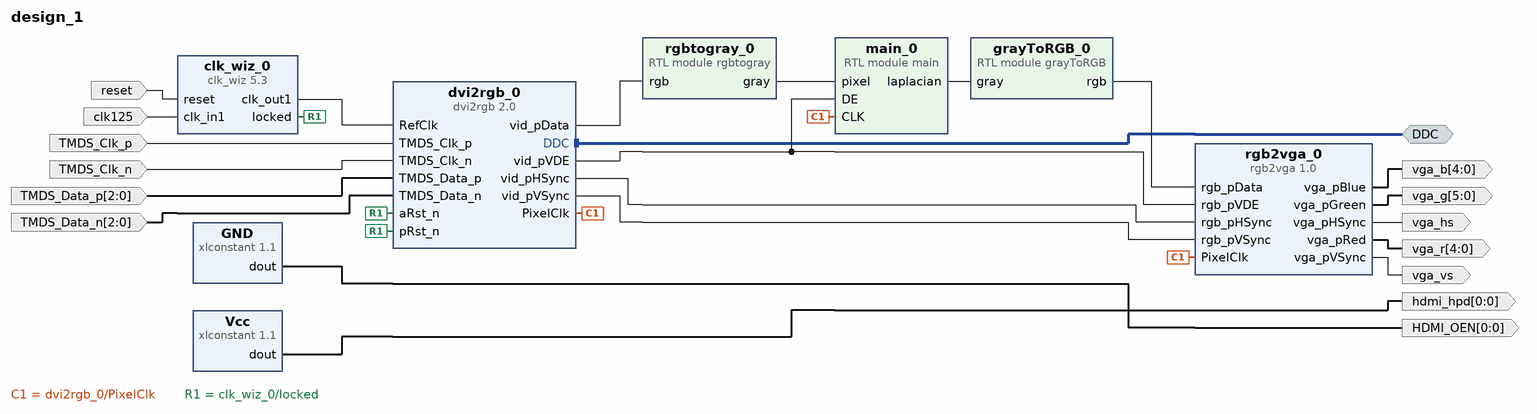
[diagram p0: block diagram of the top level]
# Vivado block design design_1, xc7z010clg400-1, Vivado 2016.4
create_bd_design design_1

create_bd_intf_port -mode Master -vlnv xilinx.com:interface:iic_rtl:1.0 DDC
create_bd_port -dir O -from 4 -to 0 vga_r
create_bd_port -dir O -from 5 -to 0 vga_g
create_bd_port -dir O -from 4 -to 0 vga_b
create_bd_port -dir O vga_hs
create_bd_port -dir O vga_vs
create_bd_port -dir I -type clk TMDS_Clk_p
set_property -dict {CONFIG.FREQ_HZ 100000000} [get_bd_ports TMDS_Clk_p]
create_bd_port -dir I -type clk TMDS_Clk_n
set_property -dict {CONFIG.FREQ_HZ 100000000} [get_bd_ports TMDS_Clk_n]
create_bd_port -dir I -from 2 -to 0 TMDS_Data_p
create_bd_port -dir I -from 2 -to 0 TMDS_Data_n
create_bd_port -dir O -from 0 -to 0 HDMI_OEN
create_bd_port -dir O -from 0 -to 0 hdmi_hpd
create_bd_port -dir I -type rst reset
set_property -dict {CONFIG.POLARITY ACTIVE_HIGH} [get_bd_ports reset]
create_bd_port -dir I -type clk clk125
set_property -dict {CONFIG.FREQ_HZ 125000000 CONFIG.CLK_DOMAIN design_1_clk125} [get_bd_ports clk125]

create_bd_cell -type ip -vlnv digilentinc.com:ip:rgb2vga:1.0 rgb2vga_0
set_property -dict {CONFIG.kBlueDepth 5 CONFIG.kGreenDepth 6 CONFIG.kRedDepth 5} [get_bd_cells rgb2vga_0]
create_bd_cell -type module -reference rgbtogray rgbtogray_0
create_bd_cell -type module -reference grayToRGB grayToRGB_0
create_bd_cell -type ip -vlnv xilinx.com:ip:xlconstant:1.1 GND
set_property -dict {CONFIG.CONST_VAL 0} [get_bd_cells GND]
create_bd_cell -type ip -vlnv xilinx.com:ip:xlconstant:1.1 Vcc
create_bd_cell -type ip -vlnv xilinx.com:ip:clk_wiz:5.3 clk_wiz_0
set_property -dict [list \
  CONFIG.PRIMITIVE PLL \
  CONFIG.PRIM_IN_FREQ 125.000 \
  CONFIG.CLKIN1_JITTER_PS 80.0 \
  CONFIG.CLKOUT1_REQUESTED_OUT_FREQ 100 \
  CONFIG.CLKOUT1_DRIVES BUFG \
  CONFIG.CLKOUT2_DRIVES BUFG \
  CONFIG.CLKOUT3_DRIVES BUFG \
  CONFIG.CLKOUT4_DRIVES BUFG \
  CONFIG.CLKOUT5_DRIVES BUFG \
  CONFIG.CLKOUT6_DRIVES BUFG \
  CONFIG.CLKOUT7_DRIVES BUFG \
  CONFIG.MMCM_DIVCLK_DIVIDE 5 \
  CONFIG.MMCM_CLKFBOUT_MULT_F 36 \
  CONFIG.MMCM_CLKIN1_PERIOD 8.0 \
  CONFIG.MMCM_COMPENSATION ZHOLD \
  CONFIG.MMCM_CLKOUT0_DIVIDE_F 9 \
  CONFIG.CLK_IN1_BOARD_INTERFACE sys_clock \
  CONFIG.CLKOUT1_JITTER 237.312 \
  CONFIG.CLKOUT1_PHASE_ERROR 249.865 \
] [get_bd_cells clk_wiz_0]
create_bd_cell -type module -reference main main_0
create_bd_cell -type ip -vlnv digilentinc.com:ip:dvi2rgb:2.0 dvi2rgb_0
set_property -dict [list \
  CONFIG.kRstActiveHigh false \
  CONFIG.kClkRange 2 \
  CONFIG.kEdidFileName dgl_720p_cea.data \
] [get_bd_cells dvi2rgb_0]

# ---- connections ----

connect_bd_intf_net [get_bd_intf_ports DDC] [get_bd_intf_pins dvi2rgb_0/DDC]
connect_bd_net [get_bd_pins dvi2rgb_0/vid_pData] [get_bd_pins rgbtogray_0/rgb]
connect_bd_net [get_bd_pins rgbtogray_0/gray] [get_bd_pins main_0/pixel]
connect_bd_net [get_bd_pins main_0/laplacian] [get_bd_pins grayToRGB_0/gray]
connect_bd_net [get_bd_pins grayToRGB_0/rgb] [get_bd_pins rgb2vga_0/rgb_pData]
connect_bd_net [get_bd_pins dvi2rgb_0/PixelClk] [get_bd_pins rgb2vga_0/PixelClk] [get_bd_pins main_0/CLK]
connect_bd_net [get_bd_pins dvi2rgb_0/vid_pHSync] [get_bd_pins rgb2vga_0/rgb_pHSync]
connect_bd_net [get_bd_pins dvi2rgb_0/vid_pVSync] [get_bd_pins rgb2vga_0/rgb_pVSync]
connect_bd_net [get_bd_pins dvi2rgb_0/vid_pVDE] [get_bd_pins rgb2vga_0/rgb_pVDE] [get_bd_pins main_0/DE]
connect_bd_net [get_bd_pins rgb2vga_0/vga_pRed] [get_bd_ports vga_r]
connect_bd_net [get_bd_pins rgb2vga_0/vga_pGreen] [get_bd_ports vga_g]
connect_bd_net [get_bd_pins rgb2vga_0/vga_pBlue] [get_bd_ports vga_b]
connect_bd_net [get_bd_pins rgb2vga_0/vga_pHSync] [get_bd_ports vga_hs]
connect_bd_net [get_bd_pins rgb2vga_0/vga_pVSync] [get_bd_ports vga_vs]
connect_bd_net [get_bd_ports TMDS_Clk_p] [get_bd_pins dvi2rgb_0/TMDS_Clk_p]
connect_bd_net [get_bd_ports TMDS_Clk_n] [get_bd_pins dvi2rgb_0/TMDS_Clk_n]
connect_bd_net [get_bd_ports TMDS_Data_p] [get_bd_pins dvi2rgb_0/TMDS_Data_p]
connect_bd_net [get_bd_ports TMDS_Data_n] [get_bd_pins dvi2rgb_0/TMDS_Data_n]
connect_bd_net -net xlconstant_0_dout [get_bd_pins GND/dout] [get_bd_ports HDMI_OEN]
connect_bd_net -net xlconstant_1_dout [get_bd_pins Vcc/dout] [get_bd_ports hdmi_hpd]
connect_bd_net [get_bd_ports reset] [get_bd_pins clk_wiz_0/reset]
connect_bd_net -net clk125_1 [get_bd_ports clk125] [get_bd_pins clk_wiz_0/clk_in1]
connect_bd_net [get_bd_pins clk_wiz_0/clk_out1] [get_bd_pins dvi2rgb_0/RefClk]
connect_bd_net -net util_vector_logic_0_Res [get_bd_pins clk_wiz_0/locked] [get_bd_pins dvi2rgb_0/aRst_n] [get_bd_pins dvi2rgb_0/pRst_n]

validate_bd_design
save_bd_design
